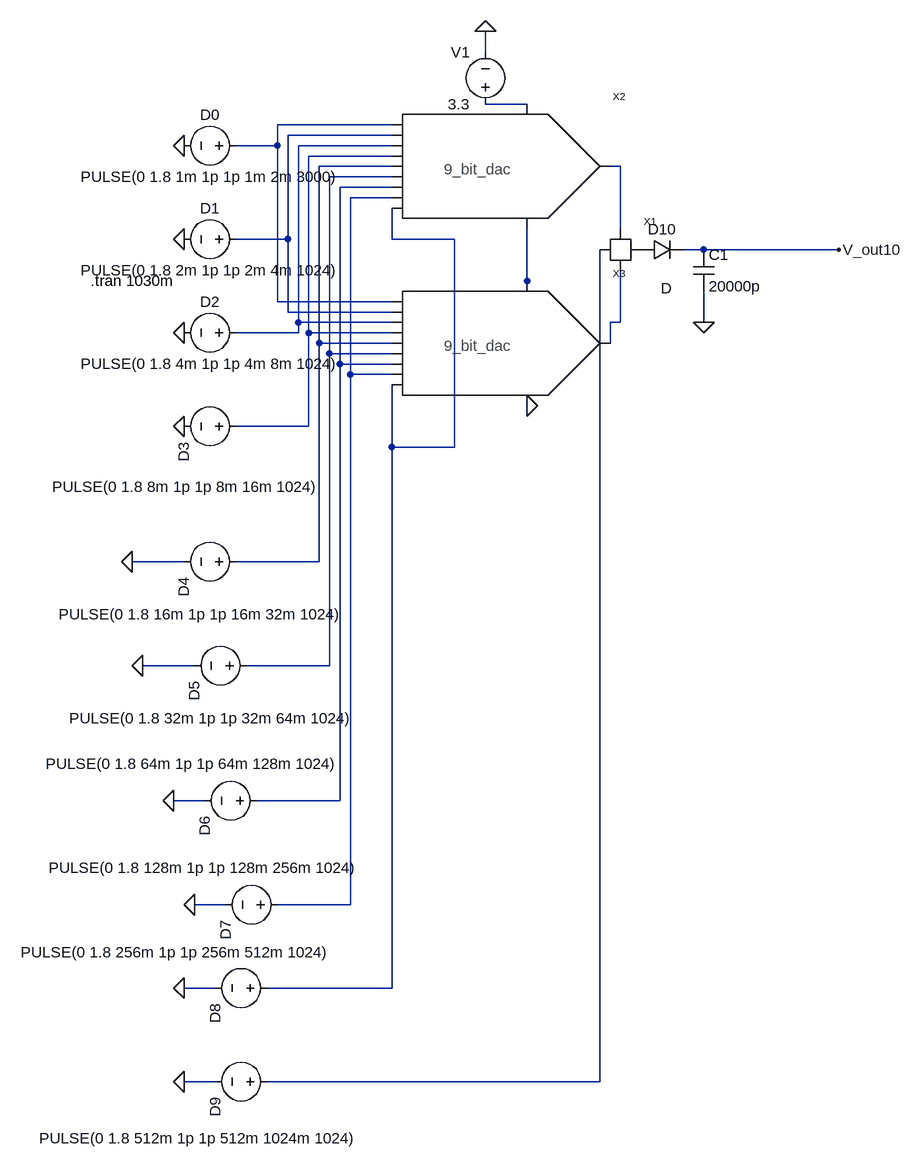
[diagram p0: schematic 10_bit_dac.asc]
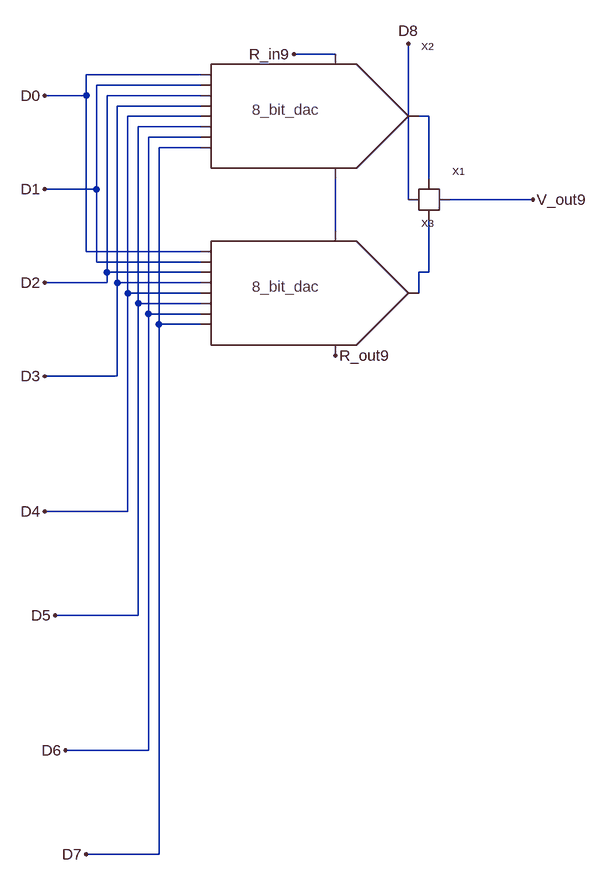
[diagram p1: sub-circuit 9_bit_dac.asc]
10_bit_dac.asc, the LTspice schematic file:
Version 4
SHEET 1 880 1688
WIRE 32 0 32 -32
WIRE 96 80 32 80
WIRE -112 112 -288 112
WIRE -112 128 -272 128
WIRE -288 144 -288 112
WIRE -288 144 -352 144
WIRE -112 144 -256 144
WIRE -112 160 -240 160
WIRE -112 176 -224 176
WIRE 240 176 224 176
WIRE -112 192 -208 192
WIRE -112 208 -192 208
WIRE -112 224 -176 224
WIRE 240 272 240 176
WIRE -272 288 -272 128
WIRE -272 288 -352 288
WIRE -112 288 -112 240
WIRE -16 288 -112 288
WIRE 368 304 336 304
WIRE 576 304 368 304
WIRE 96 352 96 272
WIRE 96 368 96 352
WIRE -288 384 -288 144
WIRE -112 384 -288 384
WIRE -272 400 -272 288
WIRE -112 400 -272 400
WIRE -256 416 -256 144
WIRE -112 416 -256 416
WIRE 240 416 240 336
WIRE 240 416 224 416
WIRE 368 416 368 368
WIRE -256 432 -256 416
WIRE -256 432 -352 432
WIRE -240 432 -240 160
WIRE -112 432 -240 432
WIRE -224 448 -224 176
WIRE -112 448 -224 448
WIRE 224 448 224 416
WIRE -208 464 -208 192
WIRE -112 464 -208 464
WIRE -192 480 -192 208
WIRE -112 480 -192 480
WIRE -176 496 -176 224
WIRE -112 496 -176 496
WIRE -240 576 -240 432
WIRE -240 576 -352 576
WIRE -112 608 -112 512
WIRE -16 608 -16 288
WIRE -16 608 -112 608
WIRE -432 784 -512 784
WIRE -224 784 -224 448
WIRE -224 784 -352 784
WIRE -416 944 -496 944
WIRE -208 944 -208 464
WIRE -208 944 -336 944
WIRE -400 1152 -448 1152
WIRE -192 1152 -192 480
WIRE -192 1152 -320 1152
WIRE -368 1312 -416 1312
WIRE -176 1312 -176 496
WIRE -176 1312 -288 1312
WIRE -384 1440 -432 1440
WIRE -112 1440 -112 608
WIRE -112 1440 -304 1440
WIRE -384 1584 -432 1584
WIRE 208 1584 208 304
WIRE 208 1584 -304 1584
FLAG -432 144 0
FLAG -432 288 0
FLAG -432 576 0
FLAG -432 432 0
FLAG -512 784 0
FLAG 32 -32 0
FLAG -432 1584 0
FLAG 576 304 V_out10
FLAG -496 944 0
FLAG -448 1152 0
FLAG 96 544 0
FLAG -416 1312 0
FLAG -432 1440 0
FLAG 368 416 0
SYMBOL switch 240 304 R0
SYMATTR InstName X1
SYMBOL voltage -336 144 R90
WINDOW 0 -32 56 VBottom 2
WINDOW 3 32 56 VTop 2
WINDOW 123 0 0 Left 0
WINDOW 39 0 0 Left 0
SYMATTR InstName D0
SYMATTR Value PULSE(0 1.8 1m 1p 1p 1m 2m 3000)
SYMBOL voltage -336 288 R90
WINDOW 0 -32 56 VBottom 2
WINDOW 3 32 56 VTop 2
WINDOW 123 0 0 Left 0
WINDOW 39 0 0 Left 0
SYMATTR InstName D1
SYMATTR Value PULSE(0 1.8 2m 1p 1p 2m 4m 1024)
SYMBOL voltage -336 576 R90
WINDOW 0 24 96 Left 2
WINDOW 3 93 -113 VRight 2
WINDOW 123 0 0 Left 0
WINDOW 39 0 0 Left 0
SYMATTR InstName D3
SYMATTR Value PULSE(0 1.8 8m 1p 1p 8m 16m 1024)
SYMBOL voltage -336 432 R90
WINDOW 0 -32 56 VBottom 2
WINDOW 3 32 56 VTop 2
WINDOW 123 0 0 Left 0
WINDOW 39 0 0 Left 0
SYMATTR InstName D2
SYMATTR Value PULSE(0 1.8 4m 1p 1p 4m 8m 1024)
SYMBOL voltage -336 784 R90
WINDOW 0 24 96 Left 2
WINDOW 3 81 289 VLeft 2
WINDOW 123 0 0 Left 0
WINDOW 39 0 0 Left 0
SYMATTR InstName D4
SYMATTR Value PULSE(0 1.8 16m 1p 1p 16m 32m 1024)
SYMBOL voltage 32 96 R180
WINDOW 0 24 96 Left 2
WINDOW 3 24 16 Left 2
WINDOW 123 0 0 Left 0
WINDOW 39 0 0 Left 0
SYMATTR InstName V1
SYMATTR Value 3.3
SYMBOL voltage -288 1584 R90
WINDOW 0 24 96 Left 2
WINDOW 3 87 -126 VRight 2
WINDOW 123 0 0 Left 0
WINDOW 39 0 0 Left 0
SYMATTR InstName D9
SYMATTR Value PULSE(0 1.8 512m 1p 1p 512m 1024m 1024)
SYMBOL voltage -320 944 R90
WINDOW 0 24 96 Left 2
WINDOW 3 81 289 VLeft 2
WINDOW 123 0 0 Left 0
WINDOW 39 0 0 Left 0
SYMATTR InstName D5
SYMATTR Value PULSE(0 1.8 32m 1p 1p 32m 64m 1024)
SYMBOL voltage -304 1152 R90
WINDOW 0 24 96 Left 2
WINDOW 3 -57 -111 VRight 2
WINDOW 123 0 0 Left 0
WINDOW 39 0 0 Left 0
SYMATTR InstName D6
SYMATTR Value PULSE(0 1.8 64m 1p 1p 64m 128m 1024)
SYMBOL voltage -272 1312 R90
WINDOW 0 24 96 Left 2
WINDOW 3 -57 -111 VRight 2
WINDOW 123 0 0 Left 0
WINDOW 39 0 0 Left 0
SYMATTR InstName D7
SYMATTR Value PULSE(0 1.8 128m 1p 1p 128m 256m 1024)
SYMBOL 9_bit_dac -16 176 R0
SYMATTR InstName X2
SYMBOL 9_bit_dac -16 448 R0
SYMATTR InstName X3
SYMBOL voltage -288 1440 R90
WINDOW 0 24 96 Left 2
WINDOW 3 -55 -84 VRight 2
WINDOW 123 0 0 Left 0
WINDOW 39 0 0 Left 0
SYMATTR InstName D8
SYMATTR Value PULSE(0 1.8 256m 1p 1p 256m 512m 1024)
SYMBOL cap 352 304 R0
SYMATTR InstName C1
SYMATTR Value 20000p
SYMBOL diode 272 320 R270
WINDOW 0 32 32 VTop 2
WINDOW 3 -28 39 VBottom 2
SYMATTR InstName D10
TEXT -576 352 Left 2 !.tran 1030m

9_bit_dac.asc, the sub-circuit schematic file:
Version 4
SHEET 1 880 1372
WIRE 96 80 32 80
WIRE -112 112 -288 112
WIRE -112 128 -272 128
WIRE -288 144 -288 112
WIRE -288 144 -352 144
WIRE -112 144 -256 144
WIRE -112 160 -240 160
WIRE -112 176 -224 176
WIRE 240 176 224 176
WIRE -112 192 -208 192
WIRE -112 208 -192 208
WIRE -112 224 -176 224
WIRE 240 272 240 176
WIRE -272 288 -272 128
WIRE -272 288 -352 288
WIRE 208 304 208 64
WIRE 400 304 272 304
WIRE 96 352 96 272
WIRE -288 384 -288 144
WIRE -112 384 -288 384
WIRE -272 400 -272 288
WIRE -112 400 -272 400
WIRE -256 416 -256 144
WIRE -112 416 -256 416
WIRE 240 416 240 336
WIRE 240 416 224 416
WIRE -256 432 -256 416
WIRE -256 432 -352 432
WIRE -240 432 -240 160
WIRE -112 432 -240 432
WIRE -224 448 -224 176
WIRE -112 448 -224 448
WIRE 224 448 224 416
WIRE -208 464 -208 192
WIRE -112 464 -208 464
WIRE -192 480 -192 208
WIRE -112 480 -192 480
WIRE -176 496 -176 224
WIRE -112 496 -176 496
WIRE -240 576 -240 432
WIRE -240 576 -352 576
WIRE -224 784 -224 448
WIRE -224 784 -352 784
WIRE -208 944 -208 464
WIRE -208 944 -336 944
WIRE -192 1152 -192 480
WIRE -192 1152 -320 1152
WIRE -176 1312 -176 496
WIRE -176 1312 -288 1312
FLAG 400 304 V_out9
FLAG -352 144 D0
FLAG -352 288 D1
FLAG -352 432 D2
FLAG -352 576 D3
FLAG -352 784 D4
FLAG -336 944 D5
FLAG -320 1152 D6
FLAG -288 1312 D7
FLAG 208 64 D8
FLAG 32 80 R_in9
FLAG 96 544 R_out9
SYMBOL switch 240 304 R0
SYMATTR InstName X1
SYMBOL 8_bit_dac -16 176 R0
SYMATTR InstName X2
SYMBOL 8_bit_dac -16 448 R0
SYMATTR InstName X3

The netlist it stands for:
* 10_bit_dac.asc
XX1 N014 N007 N013 P001 switch  ; pins digital_input Vin_1 Vin_2 Vout
V§D0 N002 0 PULSE(0 1.8 1m 1p 1p 1m 2m 3000)
V§D1 N003 0 PULSE(0 1.8 2m 1p 1p 2m 4m 1024)
V§D3 N005 0 PULSE(0 1.8 8m 1p 1p 8m 16m 1024)
V§D2 N004 0 PULSE(0 1.8 4m 1p 1p 4m 8m 1024)
V§D4 N006 0 PULSE(0 1.8 16m 1p 1p 16m 32m 1024)
V1 N001 0 3.3
V§D9 N014 0 PULSE(0 1.8 512m 1p 1p 512m 1024m 1024)
V§D5 N008 0 PULSE(0 1.8 32m 1p 1p 32m 64m 1024)
V§D6 N009 0 PULSE(0 1.8 64m 1p 1p 64m 128m 1024)
V§D7 N010 0 PULSE(0 1.8 128m 1p 1p 128m 256m 1024)
XX2 N002 N003 N004 N005 N006 N008 N009 N010 N001 N012 N007 N011 9_bit_dac
XX3 N002 N003 N004 N005 N006 N008 N009 N010 N012 0 N013 N011 9_bit_dac
V§D8 N011 0 PULSE(0 1.8 256m 1p 1p 256m 512m 1024)
C1 V_out10 0 20000p
D10 P001 V_out10 D

* block symbol definitions
.subckt 9_bit_dac D0 D1 D2 D3 D4 D5 D6 D7 R_in9 R_out9 V_out9 D8
XX1 D8 N001 N003 V_out9 switch  ; pins digital_input Vin_1 Vin_2 Vout
XX2 D0 D1 D2 D3 D4 D5 D6 D7 R_in9 N002 N001 8_bit_dac  ; pins D0 D1 D2 D3 D4 D5 D6 D7 R_in8 R_out8 V_out8
XX3 D0 D1 D2 D3 D4 D5 D6 D7 N002 R_out9 N003 8_bit_dac  ; pins D0 D1 D2 D3 D4 D5 D6 D7 R_in8 R_out8 V_out8
.ends 9_bit_dac

.model D D
.lib standard.dio
.tran 1030m
.backanno
.end